# Altium schematic sheet PWR.SchDoc
size A4
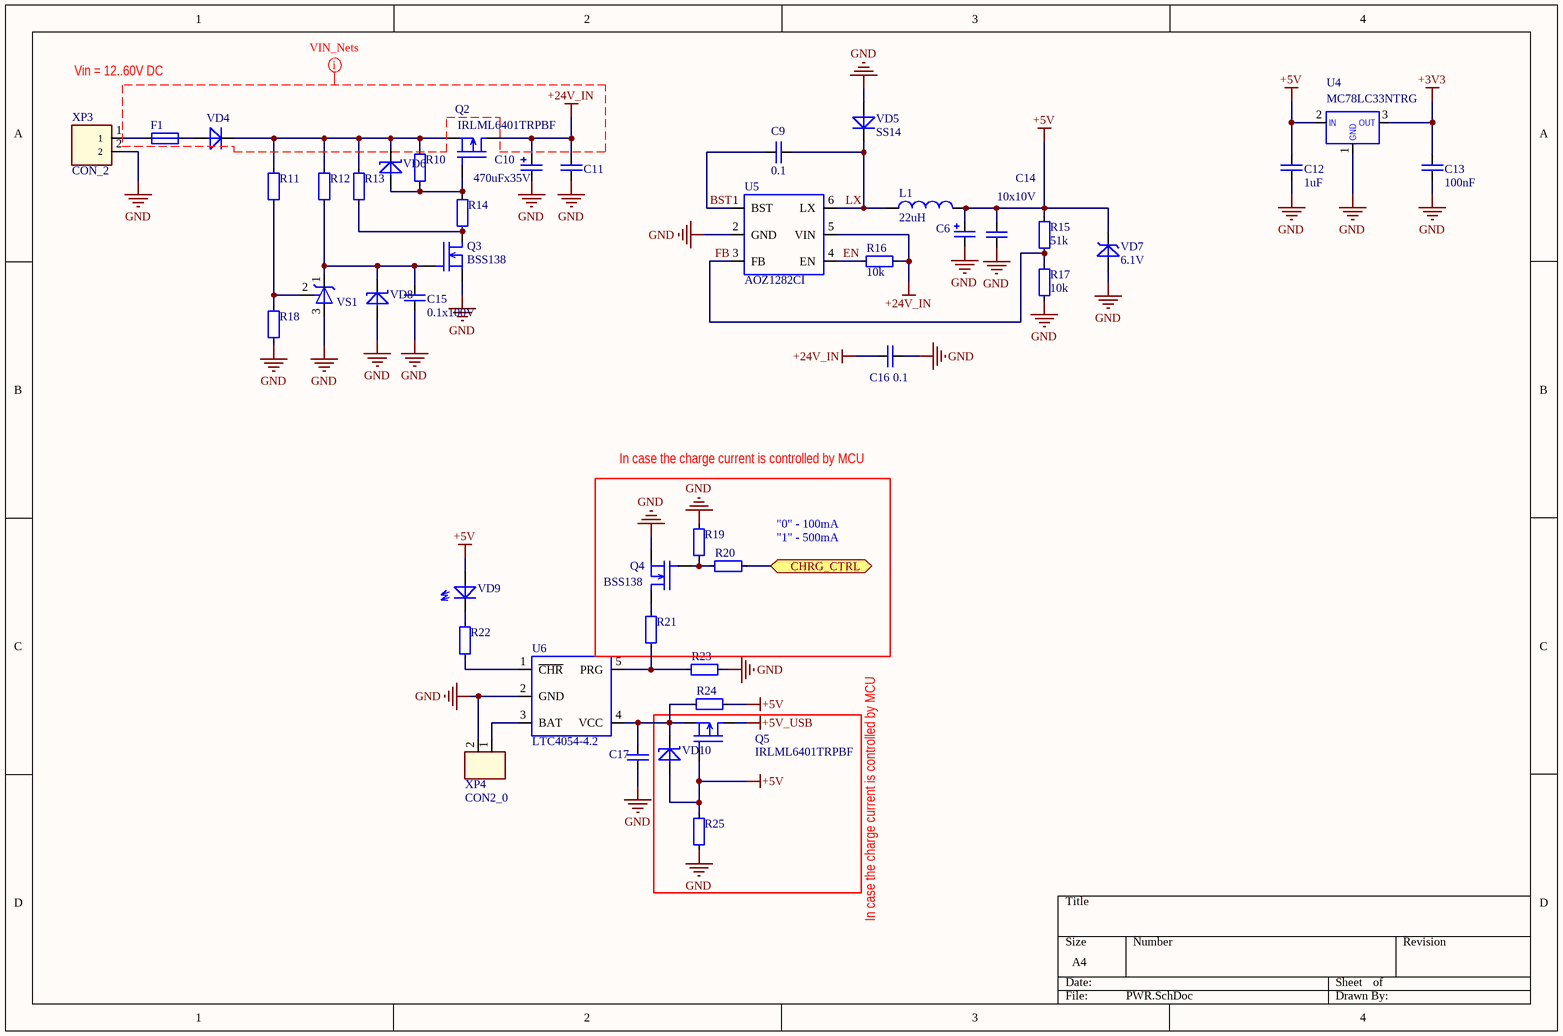
[diagram p0: PWR.SchDoc]

## Parts
C6  (no value)  [SMD_Tantalum_CAP-D]
C9  0.1  [SMD_0805]
C10  470uFx35V  [CAPR-10/5]
C11  (no value)  [SMD_0805]
C12  1uF  [SMD_0805]
C13  100nF  [SMD_0805]
C14  10x10V  [SMD_0805]
C15  0.1x100V  [SMD_0805]
C16  0.1  [SMD_0805]
C17  (no value)  [SMD_0805]
F1  (no value)  [SMD_1206]
L1  22uH  [IND-1812]
Q2  IRLML6401TRPBF  [SOT23-3PIN]
Q3  BSS138  [SOT23-3PIN]
Q4  BSS138  [SOT23-3PIN]
Q5  IRLML6401TRPBF  [SOT23-3PIN]
R10  (no value)  [SMD_0805]
R11  (no value)  [SMD_0805]
R12  (no value)  [SMD_0805]
R13  (no value)  [SMD_0805]
R14  (no value)  [SMD_0805]
R15  51k  [SMD_0805]
R16  10k  [SMD_0805]
R17  10k  [SMD_0805]
R18  (no value)  [SMD_0805]
R19  (no value)  [SMD_0805]
R20  (no value)  [SMD_0805]
R21  (no value)  [SMD_0805]
R22  (no value)  [SMD_0805]
R23  (no value)  [SMD_0805]
R24  (no value)  [SMD_0805]
R25  (no value)  [SMD_0805]
U4  MC78LC33NTRG  [SOT753]
U5  AOZ1282CI  [SOT-23-6]
U6  LTC4054-4.2  [SOT753]
VD4  (no value)  [DO214-AC]
VD5  SS14  [DO214-AC]
VD6  (no value)  [SOD-123]
VD7  6.1V  [DO214-AC]
VD8  (no value)  [SOD-123]
VD9  (no value)  [SMD_0805]
VD10  (no value)  [SOD-123]
VS1  TL431  [SOT23-3]  (value not drawn)
XP3  CON_2  [DG142V-5.08-2]
XP4  CON2_0  [MW-2M-2.0]

## Blocks framed on the sheet
In case the charge current is controlled by MCU: Q4 R19-R21

## Ports
CHRG_CTRL

## Nets
+3V3: C13.1 U4.3(OUT)
+5V: C6.1 C12.1 C14.1 L1.2 Q5.1(G) R15.2 R24.1 R25.1 U4.2(IN) VD7.1 VD9.2(A) VD10.2(A)
+5V_USB: Q5.3(D)
+24V_IN: C10.1 C11.1 C16.1 Q2.3(D) R16.1 U5.5(VIN)
GND: C6.2 C10.2 C11.2 C12.2 C13.2 C14.2 C15.2 C16.2 C17.2 Q3.2(S) Q4.2(S) R17.1 R18.1 R19.2 R23.1 R25.2 U4.1(GND) U5.2(GND) U6.2(GND) VD5.2(A) VD7.2 VD8.2(A) VS1.3 XP3.2 XP4.2
BST: C9.1 U5.1(BST)
CHRG_CTRL: R20.2 ; port CHRG_CTRL
EN: R16.2 U5.4(EN)
FB: R15.1 R17.2 U5.3(FB)
LX: C9.2 L1.1 U5.6(LX) VD5.1(C)
NetC15_1: C15.1 Q3.1(G) R12.1 VD8.1(C) VS1.1
NetC17_1: C17.1 Q5.2(S) R24.2 U6.4(VCC) VD10.1(C)
NetF1_1: F1.1 VD4.2(A)
NetF1_2: F1.2 XP3.1
NetQ2_1: Q2.1(G) R10.1 R14.2 VD6.2(A)
NetQ2_2: Q2.2(S) R10.2 R11.2 R12.2 R13.2 VD4.1(C) VD6.1(C)
NetQ3_3: Q3.3(D) R13.1 R14.1
NetQ4_1: Q4.1(G) R19.1 R20.1
NetQ4_3: Q4.3(D) R21.1
NetR11_1: R11.1 R18.2 VS1.2
NetR21_2: R21.2 R23.2 U6.5(PRG)
NetR22_1: R22.1 VD9.1(C)
NetR22_2: R22.2 U6.1(~{CHR})
NetU6_3: U6.3(BAT) XP4.1

## Layout directives
net class VIN_NETS: +24V_IN

## Notes on the sheet
- Vin = 12..60V DC
- (near R20) "0" - 100mA
  "1" - 500mA
- In case the charge current is controlled by MCU

## Library data of the parts
C6 C10 = C_POLAR: Polar capacitor
  C10: Value: 470uFx35V
C9 C11 C12 C14-C17 = C_NONE_POLAR: None polar capacitor
  C9 C16: Value: 0.1; Case: *
  C11 C17: Case: *
  C12: Value: 1uF
  C14: Value: 10x10V; Case: *
  C15: Value: 0.1x100V; Case: *
C13 = C_NONE_POLAR: None polar capacitor; Value: 100n
F1 = FUSE: Resistor
L1 = INDUCTOR: Value: 22uH
Q2 Q5 = IRLML6401TRPBF: P-Channel; Manufacture: IR; Rds: 0.05Ohm; Vds: 12V; Ids: 3.4A; Model: IRLML6401TRPBF; HelpURL: http://www.kosmodrom.com.ua/pdf/IRLML6401TRPBF.pdf; Case: SOT-23-6
Q3 Q4 = BSS138: IG-FET N-Channel; Manufacture: Fairchild; Model: BSS138; HelpURL: https://cdn.sparkfun.com/datasheets/BreakoutBoards/BSS138.pdf; Case: SOT-23
R10-R25 = RES: Resistor; Case: *
  R15: Value: 51k
  R16 R17: Value: 10k
U4 = MC78LC33NTRG: Low dropout Linear Voltage Regulator
U5 = AOZ1282CI: Buck regulator; Help: *; Value: AOZ1282CI
U6 = LTC4054-4.2: Buck regulator; Help: *; Value: LTC4054-4.2
VD4 VD5 = DIODE: Case: *
  VD5: Value: SS14
VD6 VD8 VD10 = ZENER: Zener diode
VD7 = DIOSE_TVS: TVS Diode; Value: 6.1V
VD9 = LED
XP3 = CON_2: Value: DG142V-5.08-02P-14-00AH